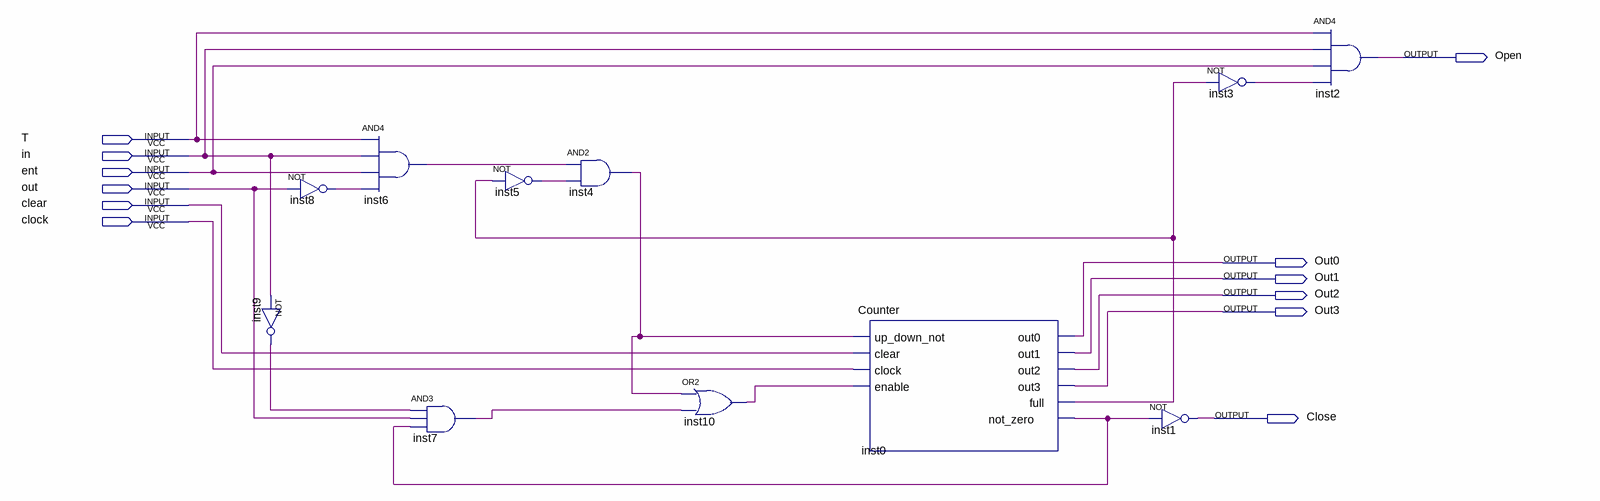
[diagram p0: schematic sheet]
// Quartus schematic Exp2.bdf as structural Verilog: 11 symbols, 12 pins
module Exp2 (
  input  T,
  input  in,
  input  ent,
  input  out,
  input  clear,
  input  clock,
  output Open,
  output Out0,
  output Out1,
  output Out2,
  output Out3,
  output Close
);

  wire inst0_full, inst0_not_zero, inst3_out, inst4_out, inst5_out, inst6_out, inst7_out, inst8_out,
       inst9_out, inst10_out;

  not inst9 (inst9_out, in);
  not inst8 (inst8_out, out);
  and inst6 (inst6_out, T, in, ent, inst8_out);
  and inst7 (inst7_out, inst9_out, out, inst0_not_zero);
  not inst5 (inst5_out, inst0_full);
  and inst4 (inst4_out, inst6_out, inst5_out);
  or inst10 (inst10_out, inst4_out, inst7_out);
  Counter inst0 (
    .up_down_not(inst4_out), .clear(clear), .clock(clock), .enable(inst10_out), .out0(Out0), .out1(Out1),
    .out2(Out2), .out3(Out3), .full(inst0_full), .not_zero(inst0_not_zero));
  not inst1 (Close, inst0_not_zero);
  not inst3 (inst3_out, inst0_full);
  and inst2 (Open, T, in, ent, inst3_out);
endmodule
